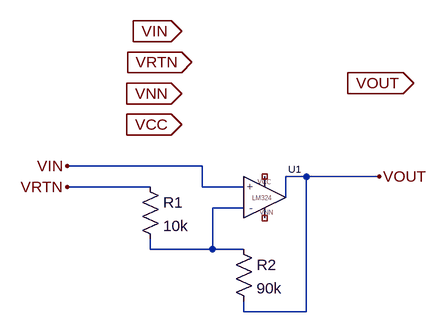
[diagram p0: schematic lab6.asc]
lab6.asc, the LTspice schematic file:
Version 4
SHEET 1 880 680
WIRE 80 48 -128 48
WIRE 240 64 208 64
WIRE 352 64 240 64
WIRE 0 80 -128 80
WIRE 80 80 80 48
WIRE 144 80 80 80
WIRE 208 96 208 64
WIRE 144 112 96 112
WIRE 0 176 0 160
WIRE 96 176 96 112
WIRE 96 176 0 176
WIRE 144 176 96 176
WIRE 144 272 144 256
WIRE 240 272 240 64
WIRE 240 272 144 272
FLAG 48 -16 VCC
IOPIN 48 -16 In
FLAG 48 -64 VNN
IOPIN 48 -64 In
FLAG 64 -112 VRTN
IOPIN 64 -112 In
FLAG 48 -160 VIN
IOPIN 48 -160 In
FLAG -128 80 VRTN
FLAG -128 48 VIN
FLAG 352 64 VOUT
FLAG 304 -80 VOUT
IOPIN 304 -80 Out
SYMBOL LM324 176 96 R0
SYMATTR InstName U1
SYMBOL res -16 64 R0
SYMATTR InstName R1
SYMATTR Value 10k
SYMBOL res 128 160 R0
SYMATTR InstName R2
SYMATTR Value 90k

The netlist it stands for:
* lab6.asc
XU1 VIN N001 NC_01 NC_02 VOUT LM324  ; pins + - Vcc Vnn Vout
R1 VRTN N001 10k
R2 N001 VOUT 90k
.backanno
.end